# EAGLE design robot (EAGLE 6.5.0)
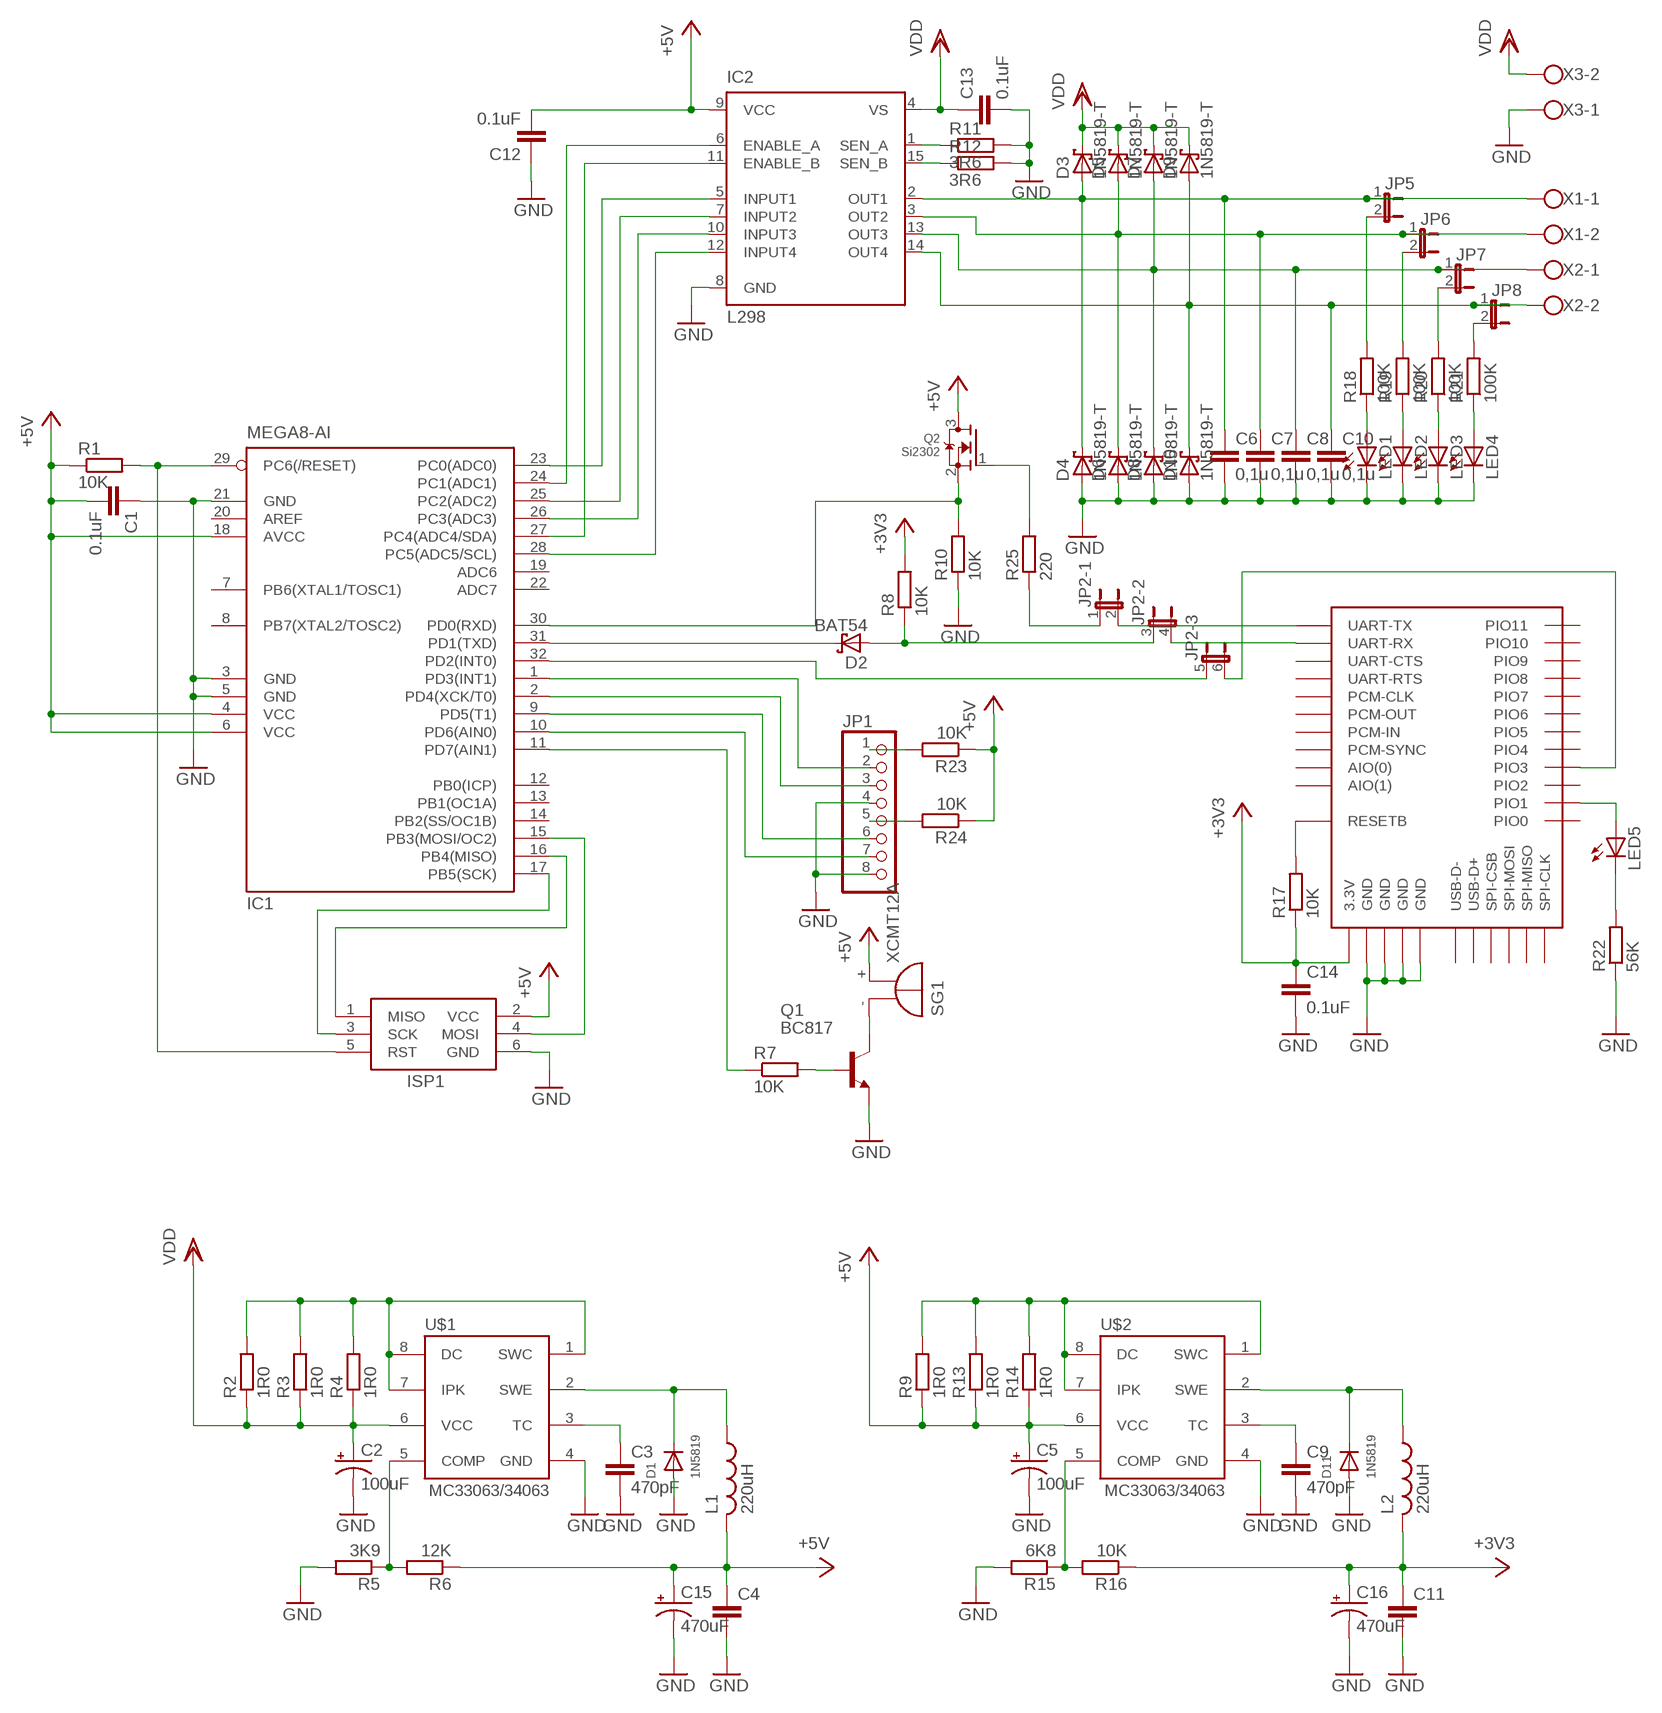
[diagram p0: schematic, sheet 1]

## Parts
C1  0.1uF  C-EUC1206K  [C1206K]
C2  100uF  CPOL-USE2-5  [E2-5]
C3  470pF  C-EUC1206K  [C1206K]
C4  C-EUC1206K  [C1206K]
C5  100uF  CPOL-USE2-5  [E2-5]
C6  0,1u  C-EUC1206  [C1206]
C7  0,1u  C-EUC1206  [C1206]
C8  0,1u  C-EUC1206  [C1206]
C9  470pF  C-EUC1206K  [C1206K]
C10  0,1u  C-EUC1206  [C1206]
C11  C-EUC1206K  [C1206K]
C12  0.1uF  C-EUC1206K  [C1206K]
C13  0.1uF  C-EUC1206K  [C1206K]
C14  0.1uF  C-EUC1206K  [C1206K]
C15  470uF  CPOL-USSANYO_E13  [SANYO-OSCON_E13]
C16  470uF  CPOL-USSANYO_E13  [SANYO-OSCON_E13]
D1  1N5819  DIODESMA  [SMADIODE]
D2  BAT54  [SOT23]
D3  1N5819-T  [DO41-7.6]
D4  1N5819-T  [DO41-7.6]
D5  1N5819-T  [DO41-7.6]
D6  1N5819-T  [DO41-7.6]
D7  1N5819-T  [DO41-7.6]
D8  1N5819-T  [DO41-7.6]
D9  1N5819-T  [DO41-7.6]
D10  1N5819-T  [DO41-7.6]
D11  1N5819  DIODESMA  [SMADIODE]
IC1  MEGA8-AI  [TQFP32-08]
IC2  L298  [MULTIWATT-15]
ISP1  AVRISP-6  [AVRISP]
JP1  PINHD-1X8_2.54-90°  [1X08/90]
JP2  JP3QE  [JP3Q]
JP5  JP1E  [JP1]
JP6  JP1E  [JP1]
JP7  JP1E  [JP1]
JP8  JP1E  [JP1]
L1  220uH  L-US6000-XXX-RC  [6000-XXXX-RC]
L2  220uH  L-US6000-XXX-RC  [6000-XXXX-RC]
LED1  LED3MM  [LED3MM]
LED2  LED3MM  [LED3MM]
LED3  LED3MM  [LED3MM]
LED4  LED3MM  [LED3MM]
LED5  LED3MM  [LED3MM]
Q1  BC817  BC817-25LT1SMD  [SOT23-BEC]
Q2  Si2302  MOSFET-NREFLOW  [SOT23]
R1  10K  R-EU_R1206  [R1206]
R2  1R0  R-EU_R1206  [R1206]
R3  1R0  R-EU_R1206  [R1206]
R4  1R0  R-EU_R1206  [R1206]
R5  3K9  R-EU_R1206  [R1206]
R6  12K  R-EU_R1206  [R1206]
R7  10K  R-EU_R1206  [R1206]
R8  10K  R-EU_R1206  [R1206]
R9  1R0  R-EU_R1206  [R1206]
R10  10K  R-EU_R1206  [R1206]
R11  3R6  R-EU_R1206  [R1206]
R12  3R6  R-EU_R1206  [R1206]
R13  1R0  R-EU_R1206  [R1206]
R14  1R0  R-EU_R1206  [R1206]
R15  6K8  R-EU_R1206  [R1206]
R16  10K  R-EU_R1206  [R1206]
R17  10K  R-EU_R1206  [R1206]
R18  100K  R-EU_R1206  [R1206]
R19  100K  R-EU_R1206  [R1206]
R20  100K  R-EU_R1206  [R1206]
R21  100K  R-EU_R1206  [R1206]
R22  56K  R-EU_R1206  [R1206]
R23  10K  R-EU_R1206  [R1206]
R24  10K  R-EU_R1206  [R1206]
R25  220  R-EU_R1206  [R1206]
SG1  XCMT12A  F/QMBIII  [F/QMBIII]
U$1  MC33063/MC34063D  [SO08]
U$2  MC33063/MC34063D  [SO08]
U$3  BTM400_6B  [BTM400_6B_SIZE]
X1  W237-102  [W237-102]
X2  W237-102  [W237-102]
X3  W237-102  [W237-102]

## Nets
+3V3: C11.1 C14.1 C16.+ L2.2 R8.2 R16.1 R17.1 U$3.3.3V
+5V: C1.2 C4.1 C5.+ C12.2 C15.+ IC1.4(VCC) IC1.6(VCC) IC1.18(AVCC) IC2.9(VCC) ISP1.2(VCC) L1.2 Q2.3(D) R1.1 R6.1 R9.1 R13.1 R14.1 R23.1 R24.1 SG1.+(-) U$2.6(VCC)
GND: C1.1 C2.- C3.2 C4.2 C5.- C6.2 C7.2 C8.2 C9.2 C10.2 C11.2 C12.1 C13.2 C14.2 C15.- C16.- D1.A D4.A D6.A D8.A D10.A D11.A IC1.3(GND) IC1.5(GND) IC1.21(GND) IC2.8(GND) ISP1.6(GND) JP1.4 JP1.8 LED1.K(C) LED2.K(C) LED3.K(C) LED4.K(C) Q1.E R5.2 R10.1 R11.2 R12.2 R15.2 R22.1 U$1.4(GND) U$2.4(GND) U$3.GND@1(GND) U$3.GND@2(GND) U$3.GND@3(GND) U$3.GND@4(GND) X3.1
N$1: IC2.1(SEN_A) R11.1
N$2: IC2.15(SEN_B) R12.1
N$3: C6.1 D3.A D4.C IC2.2(OUT1) JP5.1 X1.1
N$4: C7.1 D5.A D6.C IC2.3(OUT2) JP6.1 X1.2
N$5: JP5.2 R18.2
N$6: C10.1 D9.A D10.C IC2.14(OUT4) JP8.1 X2.2
N$7: IC1.24(PC1(ADC1)) IC2.6(ENABLE_A)
N$8: IC1.27(PC4(ADC4/SDA)) IC2.11(ENABLE_B)
N$9: IC1.23(PC0(ADC0)) IC2.5(INPUT1)
N$10: IC1.25(PC2(ADC2)) IC2.7(INPUT2)
N$11: IC1.26(PC3(ADC3)) IC2.10(INPUT3)
N$12: IC1.28(PC5(ADC5/SCL)) IC2.12(INPUT4)
N$13: IC1.1(PD3(INT1)) JP1.2
N$14: IC1.2(PD4(XCK/T0)) JP1.3
N$15: IC1.9(PD5(T1)) JP1.6
N$16: IC1.10(PD6(AIN0)) JP1.7
N$17: Q1.C SG1.-(+)
N$18: Q1.B R7.2
N$19: R17.2 U$3.RESETB
N$20: JP6.2 R19.2
N$21: JP7.2 R20.2
N$22: C8.1 D7.A D8.C IC2.13(OUT3) JP7.1 X2.1
N$23: JP8.2 R21.2
N$24: LED1.A R18.1
N$25: LED2.A R19.1
N$26: LED3.A R20.1
N$27: LED4.A R21.1
N$28: D2.1(A) JP2.3 R8.1
N$29: IC1.11(PD7(AIN1)) R7.1
N$30: R2.2 R3.2 R4.2 U$1.1(SWC) U$1.7(IPK) U$1.8(DC)
N$31: D1.C L1.1 U$1.2(SWE)
N$32: R5.1 R6.2 U$1.5(COMP)
N$33: C3.1 U$1.3(TC)
N$34: LED5.K(C) R22.2
N$35: D2.3(C) IC1.31(PD1(TXD))
N$36: JP2.1 R25.1
N$37: LED5.A U$3.PIO(1)(PIO1)
N$38: IC1.30(PD0(RXD)) Q2.2(S) R10.2
N$39: IC1.29(PC6(/RESET)) ISP1.5(RST) R1.2
N$40: IC1.15(PB3(MOSI/OC2)) ISP1.4(MOSI)
N$41: IC1.16(PB4(MISO)) ISP1.1(MISO)
N$42: IC1.17(PB5(SCK)) ISP1.3(SCK)
N$43: JP2.6 U$3.PIO(3)(PIO3)
N$44: R9.2 R13.2 R14.2 U$2.1(SWC) U$2.7(IPK) U$2.8(DC)
N$45: R15.1 R16.2 U$2.5(COMP)
N$46: C9.1 U$2.3(TC)
N$47: D11.C L2.1 U$2.2(SWE)
N$48: JP1.1 R23.2
N$49: JP1.5 R24.2
N$50: JP2.2 U$3.UART-TX
N$51: JP2.4 U$3.UART-RX
N$52: IC1.32(PD2(INT0)) JP2.5
N$56: Q2.1(G) R25.2
VDD: C2.+ C13.1 D3.C D5.C D7.C D9.C IC2.4(VS) R2.1 R3.1 R4.1 U$1.6(VCC) X3.2
Unconnected: IC1.7(PB6(XTAL1/TOSC1)) IC1.8(PB7(XTAL2/TOSC2)) IC1.12(PB0(ICP)) IC1.13(PB1(OC1A)) IC1.14(PB2(SS/OC1B)) IC1.19(ADC6) IC1.20(AREF) IC1.22(ADC7) U$3.AIO(0) U$3.AIO(1) U$3.PCM-CLK U$3.PCM-IN U$3.PCM-OUT U$3.PCM-SYNC U$3.PIO(0)(PIO0) U$3.PIO(2)(PIO2) U$3.PIO(4)(PIO4) U$3.PIO(5)(PIO5) U$3.PIO(6)(PIO6) U$3.PIO(7)(PIO7) U$3.PIO(8)(PIO8) U$3.PIO(9)(PIO9) U$3.PIO(10)(PIO10) U$3.PIO(11)(PIO11) U$3.SPI-CLK U$3.SPI-CSB U$3.SPI-MISO U$3.SPI-MOSI U$3.UART-CTS U$3.UART-RTS U$3.USB-D+ U$3.USB-D-

## Library data of the parts
C1 C3 C4 C9 C11-C14 = rcl:C-EU: CAPACITOR, European symbol
C2 C5 C15 C16 = rcl:CPOL-US: POLARIZED CAPACITOR, American symbol
C6-C8 C10 = resistor:C-EU: CAPACITOR, European symbol
D1 D11 = adafruit:DIODE: Diode SMADIODE - SMA Surface Mount Package 20V 1A Schottky Diode Digikey: 641-1014-6-ND DO-1N4148 - Through Hole Small Current Diode SOD-123 20V 1 A (.5mV Vf) Schottky Diode - Digikey: MBRX120TPMSCT-ND SOD-323 10V 570mA (.38mV Vf, 3ns) Schottky Diode - Digikey: ZLLS410CT-ND SOD-523 30V 30mA Schottky Diode (RB751S-40TE61) - Digikey: RB751S-40TE61CT-ND SOT23-R/W - SOT23 Package (R = Solder Paste/Reflow Ovens, W = Hand-Soldering) BAT54Film 40V 300mA - Digikey: 497-7162-1-ND
D2 = diode:BAT54: Schottky Diodes Source: Fairchild .. BAT54.pdf
D3-D10 = diode:1N581*: 1.0A SCHOTTKY BARRIER RECTIFIER Source: http://www.diodes.com/datasheets/ds23001.pdf
IC1 = atmel:MEGA8: MICROCONTROLLER 8 Kbytes FLASH, 1 kbytes SRAM, 512 bytes EEPROM, USART, 6-channel 10 bit ADC, 2-channel 8 bit ADC Pin compatible with Atmega48, ATMega88, ATMega168 Source: avr.lbr; MPN: ATMEGA8-16AU; OC_FARNELL: 9171371; OC_NEWARK: 73M8863
IC2 = st-microelectronics:L298: DUAL FULL-BRIDGE DRIVER; MPN: L298N; OC_FARNELL: 1589425; OC_NEWARK: 32M1527
ISP1 = adafruit:AVRISP: AVR ISP HEADER Standard 6 pin header for AVR programming
JP1 = pinhead-1:PINHD-1X8: PIN HEADER
JP2 = jumper:JP3QE: JUMPER
JP5-JP8 = jumper:JP1E: JUMPER
L1 L2 = rcl:L-US: INDUCTOR, American symbol
LED1-LED5 = adafruit:LED: LED OSRAM: - CHIPLED LG R971, LG N971, LY N971, LG Q971, LY Q971, LO R971, LY R971 LH N974, LH R974 LS Q976, LO Q976, LY Q976 LO Q996 - Hyper CHIPLED LW Q18S LB Q993, LB Q99A, LB R99A - SideLED LS A670, LO A670, LY A670, LG A670, LP A670 LB A673, LV A673, LT A673, LW A673 LH A674 LY A675 LS A676, LA A676, LO A676, LY A676, LW A676 LS A679, LY A679, LG A679 - Hyper Micro SIDELED® LS Y876, LA Y876, LO Y876, LY Y876 LT Y87S - SmartLED LW L88C, LW L88S LB L89C, LB L89S, LG L890 LS L89K, LO L89K, LY L89K LS L896, LA L896, LO L896, LY L896 - TOPLED LS T670, LO T670, LY T670, LG T670, LP T670 LSG T670, LSP T670, LSY T670, LOP T670, LYG T670 LG T671, LOG T671, LSG T671 LB T673, LV T673, LT T673, LW T673 LH T674 LS T676, LA T676, LO T676, LY T676, LB T676, LH T676, LSB T676, LW T676 LB T67C, LV T67C, LT T67C, LS T67K, LO T67K, LY T67K, LW E67C LS E67B, LA E67B, LO E67B, LY E67B, LB E67C, LV E67C, LT E67C LW T67C LS T679, LY T679, LG T679 LS T770, LO T770, LY T770, LG T770, LP T770 LB T773, LV T773, LT T773, LW T773 LH T774 LS E675, LA E675, LY E675, LS T675 LS T776, LA T776, LO T776, LY T776, LB T776 LHGB T686 LT T68C, LB T68C - Hyper Mini TOPLED® LB M676 - Mini TOPLED Santana® LG M470 LS M47K, LO M47K, LY M47K Source: http://www.osram.convergy.de/
Q1 = transistor-npn:BC817*: NPN Transistor
Q2 = adafruit:MOSFET-N: N-Channel Mosfet 2N7002E - 60V 260mA SOT23 [Digikey: 2N7002ET1GOSTR-ND] - REEL BSH103 - 30V 850mA SOT23 [Digikey: 568-5013-1-ND]
R1-R25 = rcl:R-EU_: RESISTOR, European symbol
SG1 = buzzer:F/QMBIII: BUZZER Source: Buerklin; OC_FARNELL: unknown; OC_NEWARK: unknown
U$1 U$2 = adafruit:MC33063/MC34063: MC33063 and MC34063 Basic DC/DC converter with internal power-NPN transistor, 100KHz, 1.5A peak switch current. 3-40 input/output.
U$3 = mypin:BTM400_6B
X1-X3 = con-wago-500:W237-102: WAGO SCREW CLAMP; MPN: 237-102; OC_FARNELL: unknown; OC_NEWARK: 70K9898

## Net classes
0 default: clearance 0.205 mm

## Board
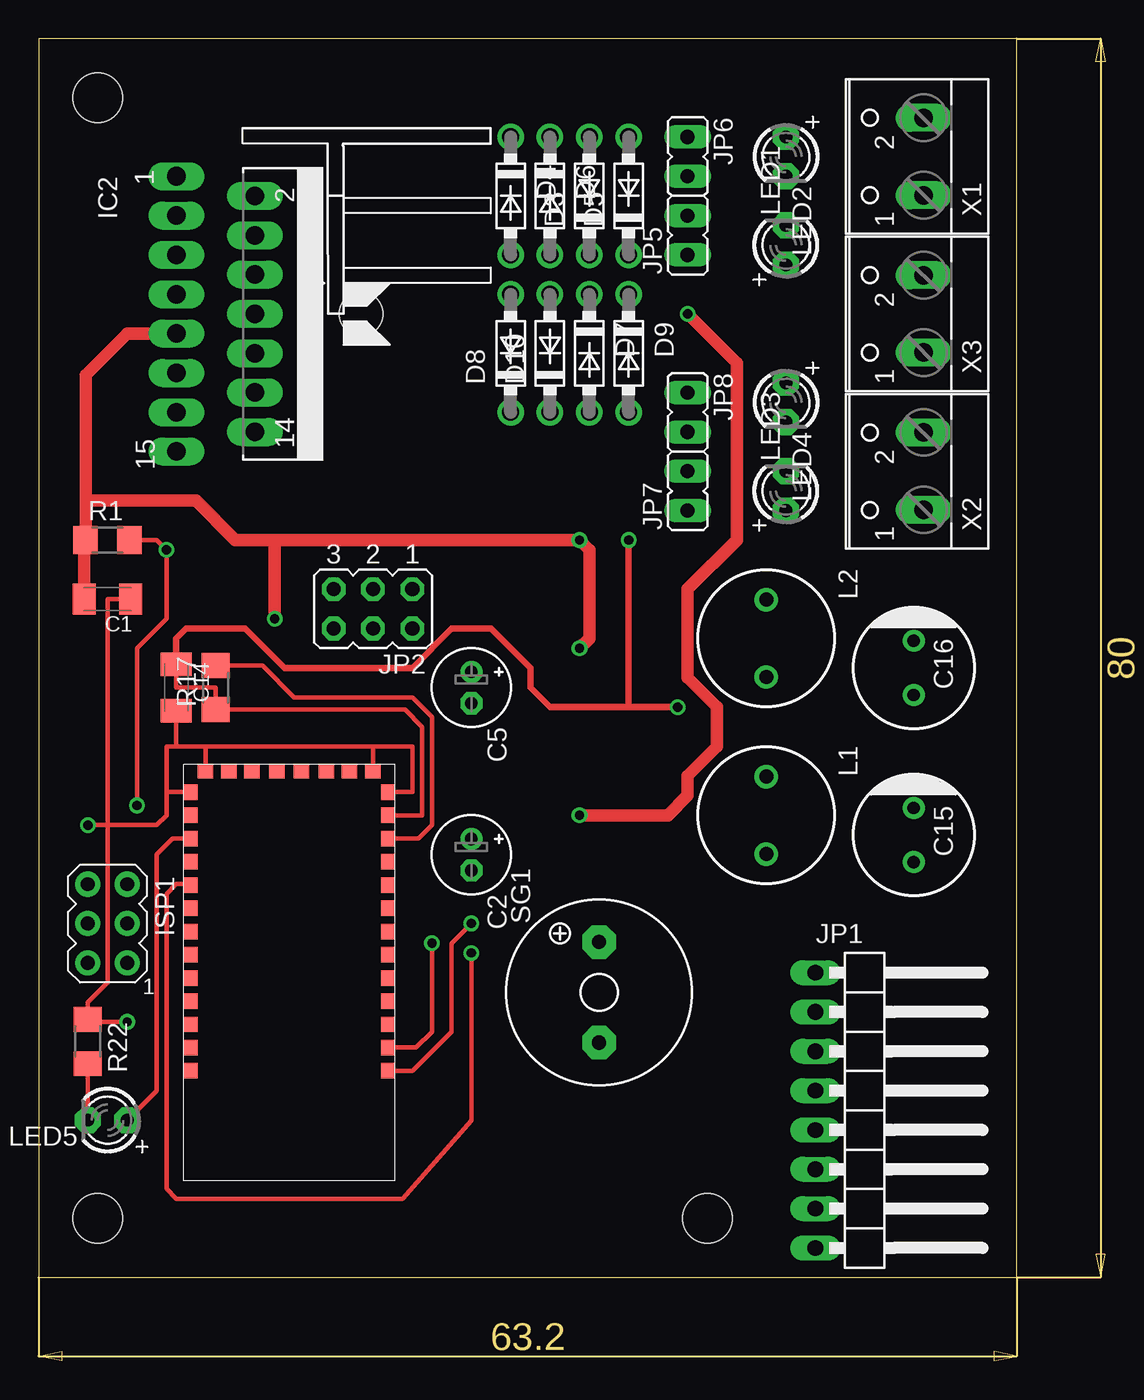
[diagram p1: board, top side]
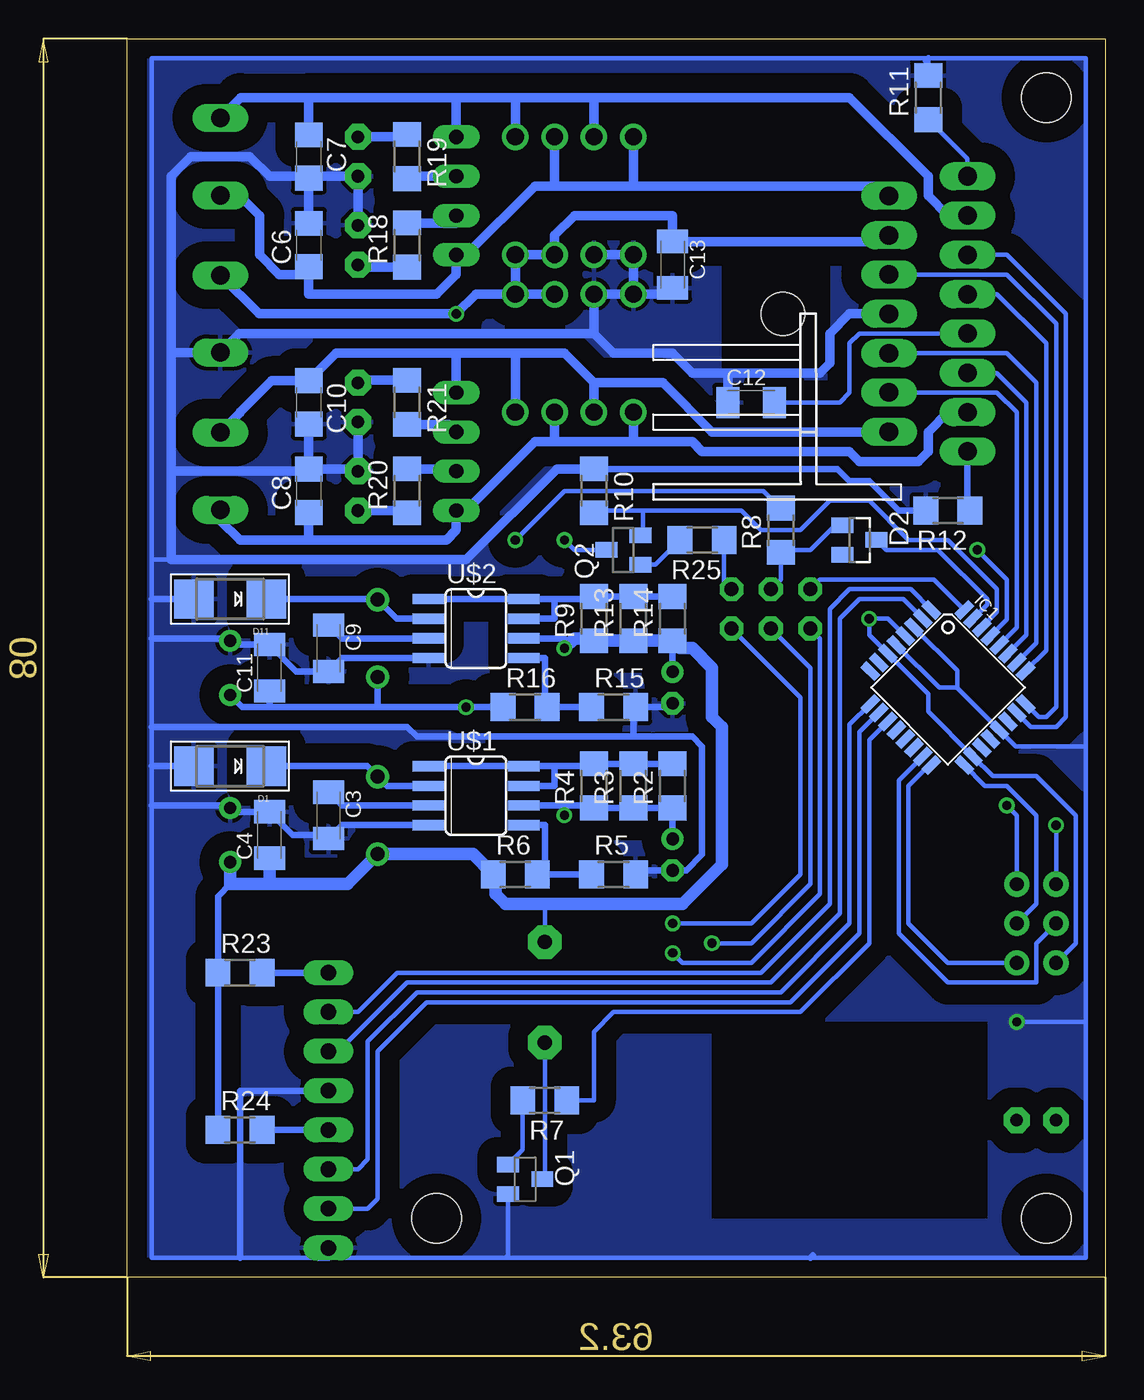
[diagram p2: board, bottom side, seen from below]

Size 63.17 x 80 mm. Coordinates in mm from the lower left corner, seen from the top.
Outline: 0,0 63.17,0 63.17,80 0,80 0,0
Copper layers (1*16): Top 0.035mm / dielectric 1.5mm / Bottom 0.035mm
Design rules "default *": minimum track width 7mil, minimum drill 20mil, track to track 8mil, track to pad 8mil, pad to pad 8mil, via to via 8mil, smd to smd 7mil, copper to edge 40mil, drill to drill 40mil, minimum pad ring 12mil, minimum via ring 8mil, stop-mask expansion 4mil, vias tented up to drill 0mil, thermal gap 10mil
Holes 3.2 mm at 3.81,3.81 3.81,76.2 43.18,3.81

### Footprints (pad centres in the part's own frame; a part is rotated, then mirrored left to right if it is on the bottom)
C1206K = smd 1.5 x 2: 1 -1.5,0; 2 1.5,0
E2-5 = drill 0.813 pad 1.27: + -1.016,0 | drill 0.813 pad 1.27 octagon: - 1.016,0
C1206 = smd 1.6 x 1.8: 1 -1.4,0; 2 1.4,0
SANYO-OSCON_E13 = drill 0.8 pad 1.27: + 1.75,0; - -1.75,0
SMADIODE = smd 2.54 x 2.54: A 2.349,0; C -2.349,0
SOT23 = smd 1 x 1.4: 1 -0.95,-1.1; 2 0.95,-1.1; 3 0,1.1
DO41-7.6 = drill 1.1 pad 1.7: A 3.81,0; C -3.81,0
TQFP32-08 = smd 1.27 x 0.559: 1 -4.293,2.8; 2 -4.293,2; 3 -4.293,1.2; 4 -4.293,0.4; 5 -4.293,-0.4; 6 -4.293,-1.2; 7 -4.293,-2; 8 -4.293,-2.8; 17 4.293,-2.8; 18 4.293,-2; 19 4.293,-1.2; 20 4.293,-0.4; 21 4.293,0.4; 22 4.293,1.2; 23 4.293,2; 24 4.293,2.8 | smd 0.559 x 1.27: 9 -2.8,-4.293; 10 -2,-4.293; 11 -1.2,-4.293; 12 -0.4,-4.293; 13 0.4,-4.293; 14 1.2,-4.293; 15 2,-4.293; 16 2.8,-4.293; 25 2.8,4.293; 26 2,4.293; 27 1.2,4.293; 28 0.4,4.293; 29 -0.4,4.293; 30 -1.2,4.293; 31 -2,4.293; 32 -2.8,4.293
MULTIWATT-15 = drill 1.2 long: 1 -8.89,-7.62; 2 -7.62,-2.54; 3 -6.35,-7.62; 4 -5.08,-2.54; 5 -3.81,-7.62; 6 -2.54,-2.54; 7 -1.27,-7.62; 8 0,-2.54; 9 1.27,-7.62; 10 2.54,-2.54; 11 3.81,-7.62; 12 5.08,-2.54; 13 6.35,-7.62; 14 7.62,-2.54; 15 8.89,-7.62
AVRISP = drill 0.9 pad 1.626: 1 -1.27,2.54; 2 1.27,2.54; 3 -1.27,0; 4 1.27,0; 5 -1.27,-2.54; 6 1.27,-2.54
1X08/90 = drill 1.016 long: 1 -8.89,-3.81; 2 -6.35,-3.81; 3 -3.81,-3.81; 4 -1.27,-3.81; 5 1.27,-3.81; 6 3.81,-3.81; 7 6.35,-3.81; 8 8.89,-3.81
JP3Q = drill 0.914 octagon: 1 -2.54,-1.27; 2 -2.54,1.27; 3 0,-1.27; 4 0,1.27; 5 2.54,-1.27; 6 2.54,1.27
JP1 = drill 0.914 long: 1 0,-1.27; 2 0,1.27
6000-XXXX-RC = drill 0.9 pad 1.422: 1 -2.5,0; 2 2.5,0
LED3MM = drill 0.813 pad 1.676 octagon: A -1.27,0; K 1.27,0
SOT23-BEC = smd 1 x 1.4: B -0.95,-1.1; C 0,1.1; E 0.95,-1.1
R1206 = smd 1.6 x 1.803: 1 -1.422,0; 2 1.422,0
F/QMBIII = drill 0.914 pad 2.159 octagon: + 3.251,0; - -3.251,0
SO08 = smd 0.66 x 2.032: 1 -1.905,-3.073; 2 -0.635,-3.073; 3 0.635,-3.073; 4 1.905,-3.073; 5 1.905,3.073; 6 0.635,3.073; 7 -0.635,3.073; 8 -1.905,3.073
BTM400_6B_SIZE = smd 0.9 x 1: 3.3V -6.685,-10.16; AIO(0) -6.685,-5.66; AIO(1) -6.685,-7.16; GND@1 -6.685,-11.66; GND@4 6.05,-11.66; PCM-CLK -6.685,0.34; PCM-IN -6.685,-2.66; PCM-OUT -6.685,-1.16; PCM-SYNC -6.685,-4.16; PIO(0) 6.05,-10.16; PIO(1) 6.05,-8.66; PIO(2) 6.05,-7.16; PIO(3) 6.05,-5.66; PIO(4) 6.05,-4.16; PIO(5) 6.05,-2.66; PIO(6) 6.05,-1.16; PIO(7) 6.05,0.34; PIO(8) 6.05,1.84; PIO(9) 6.05,3.34; PIO(10) 6.05,4.84; PIO(11) 6.05,6.34; RESETB -6.685,-8.66; UART-CTS -6.685,3.34; UART-RTS -6.685,1.84; UART-RX -6.685,4.84; UART-TX -6.685,6.34 | smd 1 x 0.9: GND@2 -5.7,-13; GND@3 5.1,-13; SPI-CLK 2.1,-13; SPI-CSB -2.7,-13; SPI-MISO 0.5,-13; SPI-MOSI -1.1,-13; USB-D+ 3.6,-13; USB-D- -4.2,-13
HS202-20 = hole 2.8: 0,1.135
W237-102 = drill 1.194 long: 1 -2.5,-1.27; 2 2.5,-1.27

### Placement (x,y rotation side)
C1  4.45,43.81 180 top
C2  27.94,27.3 270 top
C3  50.17,29.84 270 bottom
C4  53.98,28.57 90 bottom
C5  27.94,38.1 270 top
C6  51.44,66.67 90 bottom
C7  51.44,72.39 270 bottom
C8  51.44,50.8 90 bottom
C9  50.17,40.64 270 bottom
C10  51.44,56.52 270 bottom
C11  53.98,39.37 90 bottom
C12  22.86,56.52 0 bottom
C13  27.94,65.41 270 bottom
C14  8.89,38.1 270 top
C15  56.52,28.57 270 top
C16  56.52,39.37 270 top
D1  56.52,33.02 180 bottom
D2  15.88,47.62 270 bottom
D3  35.56,69.85 90 top
D4  30.48,69.85 270 top
D5  38.1,69.85 90 top
D6  33.02,69.85 270 top
D7  35.56,59.69 270 top
D8  30.48,59.69 90 top
D9  38.1,59.69 270 top
D10  33.02,59.69 90 top
D11  56.52,43.81 180 bottom
IC1  10.16,38.1 315 bottom
IC2  16.51,62.23 270 top
ISP1  4.45,22.86 180 top
JP1  53.98,10.79 270 top
JP2  21.59,43.18 180 top
JP5  41.91,67.31 0 top
JP6  41.91,72.39 180 top
JP7  41.91,50.8 0 top
JP8  41.91,55.88 180 top
L1  46.99,29.84 270 top
L2  46.99,41.27 270 top
LED1  48.26,66.67 90 top
LED2  48.26,72.39 270 top
LED3  48.26,50.8 90 top
LED4  48.26,56.52 270 top
LED5  4.45,10.16 180 top
Q1  37.47,6.35 270 bottom
Q2  31.11,46.99 90 bottom
R1  4.45,47.62 0 top
R2  27.94,31.75 90 bottom
R3  30.48,31.75 90 bottom
R4  33.02,31.75 90 bottom
R5  31.75,26.04 0 bottom
R6  38.1,26.04 0 bottom
R7  36.2,11.43 180 bottom
R8  20.95,48.26 90 bottom
R9  33.02,42.55 90 bottom
R10  33.02,50.8 270 bottom
R11  11.43,76.2 90 bottom
R12  10.16,49.53 180 bottom
R13  30.48,42.55 90 bottom
R14  27.94,42.55 90 bottom
R15  31.75,36.83 0 bottom
R16  37.47,36.83 0 bottom
R17  11.43,38.1 90 top
R18  45.09,66.67 90 bottom
R19  45.09,72.39 270 bottom
R20  45.09,50.8 90 bottom
R21  45.09,56.52 270 bottom
R22  3.18,15.24 270 top
R23  55.88,19.68 0 bottom
R24  55.88,9.53 0 bottom
R25  26.04,47.62 180 bottom
SG1  36.2,18.41 90 top
U$1  40.64,31.11 270 bottom
U$2  40.64,41.91 270 bottom
U$3  15.88,19.68 180 top
U$4  [HS202-20]  19.69,62.23 270 top
X1  55.88,72.39 90 top
X2  55.88,52.07 90 top
X3  55.88,62.23 90 top

### Tracks (layer width: path | path; a pad name or v marks a point on that pad's centre or on a via)
+3V3  (via drill 0.6, 0.6 pad 1.02)
  Top 0.305: U$3.3.3V 24.77,29.84 24.77,35.56 23.65,36.68 R17.1 11.43,38.1 8.89,38.1 C14.1
  Top 0.406: v41.28,36.83 38.1,36.83 | 38.1,36.83 33.02,36.83 31.75,38.1 31.75,39.37 29.21,41.91 26.67,41.91 24.13,39.37 15.88,39.37 13.34,41.91 9.52,41.91 8.89,41.27 C14.1 | v38.1,47.62 38.1,36.83
  Bottom 0.305: R8.2 22.07,50.8 34.92,50.8 v38.1,47.62
  Bottom 0.406: 46.99,36.83 v41.28,36.83 R16.1 | L2.2 46.99,36.83 | 46.99,36.83 53.98,36.83 | 53.98,36.83 55.73,36.83 C16.+ | C11.1 53.98,36.83
+5V  (via drill 0.6, 0.6 pad 1.02)
  Top 0.813: IC2.9 5.72,60.96 3.02,58.27 3.02,50.16 | C1.2 2.95,47.55 R1.1 3.02,50.16 | 3.02,50.16 10.16,50.16 12.7,47.62 15.24,47.62 | 15.24,47.62 v34.92,47.62 35.56,46.99 35.56,41.27 v34.92,40.64 | 15.24,47.62 v15.24,42.55
  Bottom 0.305: IC2.9 15.88,60.96 16.51,60.33 16.51,57.15 17.15,56.52 C12.2 | IC1.4 14.04,42.55 v15.24,42.55 15.24,41.48 IC1.6 11.43,37.67 11.43,36.54 IC1.18 7.27,32.38 4.45,32.38 1.91,29.84 1.91,21.59 ISP1.2 | SG1.+ 36.2,24.13 | Q2.3 34.29,46.99 v34.92,47.62
  Bottom 0.406: 46.76,27.11 L1.2 | R9.1 33.17,41.27 | U$2.6 34.92,41.27 v34.92,40.64 | R14.1 C5.+ | R24.1 R23.1 57.3,24.61 56.52,25.4 | 39.37,25.88 R6.1
  Bottom 0.813: 39.37,25.88 39.37,24.77 38.73,24.13 36.2,24.13 27.31,24.13 24.77,26.67 24.77,35.56 25.4,36.2 25.4,39.37 26.67,40.64 27.46,40.64 R14.1 R13.1 R9.1 | 33.17,41.27 34.29,41.27 v34.92,40.64 | R6.1 40.83,27.34 L1.2 48.94,25.4 53.98,25.4 | 53.98,25.4 56.52,25.4 C15.+ | C4.1 53.98,25.4
GND  (via drill 0.6 pad 1.02)
  Top 0.305: U$3.GND@1 24.13,31.34 24.13,34.29 21.59,34.29 | 21.59,34.29 10.8,34.29 | 10.8,34.29 8.89,34.29 | 8.89,34.29 8.26,34.29 8.26,31.34 | U$3.GND@4 8.26,31.34 | U$3.GND@3 10.8,32.69 10.8,34.29 | U$3.GND@2 21.59,34.29 | C14.2 8.89,34.29 | v3.18,29.21 4.45,29.21 | 4.45,29.21 7.62,29.21 8.26,29.84 8.26,31.34 | 4.45,29.21 4.45,19.05 3.18,17.78 R22.1 3.33,16.51 v5.72,16.51 | C1.1 4.45,43.81 4.45,29.21
  Bottom 0.305: 11.43,78.74 61.59,78.74 61.59,46.35 | 11.43,78.74 1.27,78.74 1.27,34.29 | 1.27,34.29 1.27,16.51 | 1.27,16.51 1.27,1.27 19.05,1.27 38.73,1.27 | 38.73,1.27 50.17,1.27 | 50.8,1.27 55.88,1.27 61.59,1.27 61.59,30.48 61.59,33.02 61.59,35.56 61.59,41.27 61.59,43.81 61.59,46.35 | 60.33,46.35 61.59,46.35 | R11.2 11.43,78.74 | 9.56,38.06 IC1.21 5.78,34.29 1.27,34.29 | 9.56,38.06 9.59,38.1 10.73,38.1 IC1.5 | IC1.3 9.56,39.2 9.56,38.06 | ISP1.6 v3.18,29.21 | v5.72,16.51 1.27,16.51 | Q1.E 38.56,1.44 38.73,1.27
  Bottom 0.406: R5.2 30.33,26.29 C2.- 27.05,26.29 26.04,27.3 26.04,34.29 26.67,34.92 30.48,34.92 | U$1.4 49.3,29.21 C3.2 50.17,28.57 52.48,28.57 C4.2 56.27,30.07 C15.- 56.67,30.48 61.59,30.48 | C5.- 28.19,36.83 R15.2 30.48,36.68 30.48,34.92 | U$2.4 49.3,40.01 C9.2 52.25,39.14 C11.2 56.27,40.87 C16.- 56.67,41.27 61.59,41.27 | 11.58,78.59 11.43,78.74 | R12.2 13.34,49.53 15.24,51.44 16.51,51.44 17.3,52.22 R10.1 | 18.88,1.44 19.05,1.27 | 50.8,1.27 50.17,1.27 JP1.8 | JP1.4 55.88,12.06 55.88,1.27 | D11.A 61.59,43.81 | 61.59,35.56 45.09,35.56 44.45,34.92 30.48,34.92 | D1.A 61.59,33.02
  Bottom 0.61: C7.2 51.31,71.12 LED2.K LED1.K | C6.2 C7.2 | C8.2 C10.2 | C8.2 48.39,52.2 LED3.K LED4.K | D6.A D4.A D8.A | 33.02,60.96 55.92,60.96 X3.1 60.28,59.73 | 33.02,60.96 D10.A D8.A | C7.2 51.56,71.12 53.98,71.12 55.25,72.39 59.06,72.39 60.33,71.12 60.33,59.77 60.28,59.73 | 60.28,59.73 60.33,59.69 60.33,52.07 | C8.2 51.56,52.07 60.33,52.07 | 33.02,60.96 31.75,59.69 27.94,59.69 26.67,58.42 24.13,58.42 | C13.2 28.34,63.5 D8.A | 60.33,52.07 60.33,46.35 41.28,46.35 35.41,52.22 R10.1 | 24.13,58.42 18.41,58.42 17.78,59.05 17.78,60.96 16.51,62.23 IC2.8 | C12.1 24.36,58.19 24.13,58.42
  pour Bottom (isolate 1.27): -1.27,81.28 -1.27,-1.27 64.77,-1.27 64.77,81.28
N$1
  Bottom 0.305: IC2.1 8.89,72.24 R11.1
N$2
  Bottom 0.406: IC2.15 8.89,49.68 R12.1
N$3
  Bottom 0.61: 35.56,70.48 36.83,70.48 41.28,66.04 JP5.1 41.91,64.77 43.18,63.5 51.44,63.5 C6.1 51.94,64.77 53.34,64.77 54.61,66.04 54.61,68.58 55.92,69.89 X1.1 | 35.56,70.48 30.48,70.48 | D3.A 35.56,70.48 | D4.C 30.48,70.48 | IC2.2 14.61,70.48 30.48,70.48
N$4
  Bottom 0.61: 33.02,76.2 33.66,76.2 38.1,76.2 | 38.1,76.2 41.91,76.2 | 41.91,76.2 51.44,76.2 | D6.C 33.02,76.2 | D5.A 38.1,76.2 | JP6.1 41.91,76.2 | C7.1 51.44,76.2 | X1.2 55.84,76.2 51.44,76.2 | IC2.3 10.16,68.58 11.43,69.85 11.43,71.12 16.51,76.2 33.02,76.2
N$5
  Bottom 0.61: JP5.2 41.91,68.1 R18.2
N$6
  Bottom 0.61: 41.91,58.42 JP8.1 41.91,59.69 | 41.91,59.69 49.66,59.69 C10.1 53.84,57.91 55.88,55.88 55.88,55.84 X2.2 | 41.91,59.69 38.1,59.69 | D9.A 38.1,59.69 | D10.C 33.02,57.78 | IC2.14 25.4,54.61 28.58,57.78 33.02,57.78 | 33.02,57.78 34.92,59.69 38.1,59.69
N$7
  Bottom 0.305: IC2.6 6.35,64.77 3.18,61.59 3.18,36.83 3.81,36.2 4.3,36.2 IC1.24
N$8
  Bottom 0.305: IC2.11 6.98,58.42 5.08,56.52 5.08,41.48 IC1.27
N$9
  Bottom 0.305: IC2.5 6.35,66.04 2.54,62.23 2.54,36.2 3.18,35.56 4.79,35.56 IC1.23
N$10
  Bottom 0.305: IC2.7 6.98,63.5 3.81,60.33 3.81,40.49 IC1.25
N$11
  Bottom 0.305: IC2.10 6.35,59.69 4.45,57.78 4.45,40.99 IC1.26
N$12
  Bottom 0.305: IC2.12 6.98,57.15 5.72,55.88 5.72,41.98 IC1.28
N$13
  Bottom 0.305: JP1.2 48.26,17.14 45.72,19.68 22.23,19.68 17.78,24.13 17.78,43.18 16.51,44.45 12.55,44.45 IC1.1
N$14
  Bottom 0.305: JP1.3 49.53,14.61 45.09,19.05 21.59,19.05 17.15,23.5 17.15,42.55 15.88,43.81 13.05,43.81 IC1.2
N$15
  Bottom 0.305: JP1.6 48.26,6.99 47.62,7.62 47.62,15.24 44.45,18.41 20.95,18.41 16.51,22.86 16.51,35.71 IC1.9
N$16
  Bottom 0.305: JP1.7 47.62,4.45 46.99,5.08 46.99,14.61 43.81,17.78 20.32,17.78 15.88,22.23 15.88,35.21 IC1.10
N$17
  Bottom 0.305: SG1.- 36.2,6.35 Q1.C
N$18
  Bottom 0.305: R7.2 37.62,8.25 Q1.B
N$19
  Top 0.305: R17.2 14.45,39.52 16.51,37.47 24.13,37.47 25.4,36.2 25.4,29.21 24.54,28.34 U$3.RESETB
N$20
  Bottom 0.61: R19.2 45.09,71.12 JP6.2
N$21
  Bottom 0.61: JP7.2 43.18,52.07 43.33,52.22 R20.2
N$22
  Bottom 0.61: IC2.13 10.16,55.88 11.43,54.61 11.43,53.34 12.07,52.7 15.88,52.7 16.51,53.34 26.04,53.34 26.67,53.98 30.48,53.98 | 51.44,47.62 42.55,47.62 41.91,48.26 JP7.1 41.28,49.53 36.83,53.98 35.56,53.98 | 51.44,47.62 55.88,47.62 57.15,48.9 X2.1 | C8.1 51.44,47.62 | 35.56,53.98 30.48,53.98 | D7.A 35.56,53.98 | D8.C 30.48,53.98
N$23
  Bottom 0.61: JP8.2 42.39,55.09 R21.2
N$24
  Bottom 0.61: LED1.A 48.26,65.25 R18.1
N$25
  Bottom 0.61: R19.1 45.24,73.66 LED2.A
N$26
  Bottom 0.61: R20.1 45.24,49.53 LED3.A
N$27
  Bottom 0.61: LED4.A 48.11,57.94 R21.1
N$28
  Bottom 0.305: D2.1 17.47,48.58 19.05,46.99 20.8,46.99 R8.1 20.95,45.09 JP2.3
N$29
  Bottom 0.305: IC1.11 15.24,34.72 15.24,21.59 19.69,17.14 31.75,17.14 33.02,15.88 33.02,11.43 R7.1
N$30
  Bottom 0.406: R2.2 R3.2 R4.2 33.02,33.02 35.56,33.02 | 35.56,33.02 U$1.8 U$1.1 | U$1.7 35.56,31.75 35.56,33.02
N$31
  Bottom 0.406: U$1.2 46.39,31.75 L1.1 47.67,33.02 D1.C
N$32
  Bottom 0.406: R5.1 R6.2 36.2,26.52 36.2,29.21 U$1.5
N$33
  Bottom 0.406: U$1.3 49.3,30.48 C3.1
N$34
  Top 0.305: R22.2 LED5.K
N$35
  Bottom 0.305: IC1.31 7.62,43.47 7.62,43.81 10.8,46.99 14.14,46.99 D2.3
N$36
  Bottom 0.305: JP2.1 24.61,44.93 R25.1
N$37
  Top 0.305: LED5.A 7.62,12.06 7.62,27.3 8.66,28.34 U$3.PIO(1)
N$38
  Bottom 0.305: IC1.30 6.98,42.97 6.98,44.45 10.16,47.62 12.7,47.62 15.24,50.16 17.78,50.16 19.69,48.26 22.23,48.26 23.5,49.53 29.84,49.53 | 29.84,49.53 32.87,49.53 arc-90 R10.2 | Q2.2 29.84,48.11 29.84,49.53
N$39  (via drill 0.6 pad 1.02)
  Top 0.305: R1.2 7.62,47.62 v8.26,46.99 8.26,42.55 6.35,40.64 v6.35,30.48
  Bottom 0.305: IC1.29 6.35,42.48 6.35,45.09 v8.26,46.99 | ISP1.5 5.72,29.84 v6.35,30.48
N$40
  Bottom 0.305: IC1.15 13.34,32.1 13.34,22.23 10.16,19.05 4.45,19.05 4.45,21.59 ISP1.4
N$41
  Bottom 0.305: ISP1.1 10.16,20.32 12.7,22.86 12.7,31.75 11.37,33.09 IC1.16
N$42
  Bottom 0.305: ISP1.3 4.45,24.13 4.45,29.84 6.35,31.75 7.77,31.75 IC1.17
N$43  (via drill 0.6)
  Top 0.305: v27.94,20.95 27.94,10.16 23.5,5.08 8.89,5.08 8.26,5.71 8.26,24.77 8.89,25.4 9.77,25.4 U$3.PIO(3)
  Bottom 0.305: JP2.6 18.41,41.27 18.41,24.77 22.86,20.32 27.31,20.32 v27.94,20.95
N$44
  Bottom 0.406: R14.2 R13.2 R9.2 33.17,43.81 35.56,43.81 | 35.56,43.81 U$2.8 U$2.1 | U$2.7 35.56,42.55 35.56,43.81
N$45
  Bottom 0.406: R15.1 R16.2 36.2,36.83 36.2,40.01 U$2.5
N$46
  Bottom 0.406: U$2.3 49.3,41.27 C9.1
N$47
  Bottom 0.406: U$2.2 45.76,42.55 L2.1 47.03,43.81 D11.C
N$48
  Bottom 0.406: JP1.1 R23.2
N$49
  Bottom 0.406: JP1.5 R24.2
N$50  (via drill 0.6 pad 1.02)
  Top 0.305: U$3.UART-TX 24.14,13.35 26.67,15.88 26.67,21.59 v27.94,22.86
  Bottom 0.305: JP2.2 19.69,37.47 19.69,26.04 22.86,22.86 v27.94,22.86
N$51  (via drill 0.6)
  Top 0.305: U$3.UART-RX 24.37,14.85 25.4,15.88 v25.4,21.59
  Bottom 0.305: JP2.4 19.05,39.37 19.05,25.4 22.86,21.59 v25.4,21.59
N$52
  Bottom 0.305: JP2.5 18.41,45.09 11.07,45.09 IC1.32
N$53
  cutout Bottom: 5.08,38.1 10.16,43.18 15.24,38.1 10.16,33.02
N$54
  cutout Bottom: 8.89,16.51 25.4,16.51 25.4,3.81 7.62,3.81 7.62,16.51
N$55
  cutout Bottom: 17.78,66.04 17.78,58.42 24.77,58.42 24.77,66.04
N$56
  Bottom 0.305: Q2.1 29.04,46.04 R25.2
VDD  (via drill 0.6)
  Top 0.813: v41.91,62.23 45.09,59.05 45.09,47.62 41.91,44.45 41.91,38.73 43.81,36.83 43.81,34.29 41.91,32.38 41.91,31.11 40.64,29.84 v34.92,29.84
  Bottom 0.406: U$1.6 34.92,30.48 | 34.92,30.48 33.02,30.48 R4.1 R3.1 R2.1 C2.+ | v34.92,29.84 34.92,30.48
  Bottom 0.61: D9.C D5.C D3.C 35.56,67.31 34.29,68.58 27.94,68.58 C13.1 14.38,66.91 IC2.4 | D9.C D7.C | X3.2 54.65,62.23 v41.91,62.23 40.64,63.5 D9.C